# Altium project smd_challenge_extreme.PrjPCB
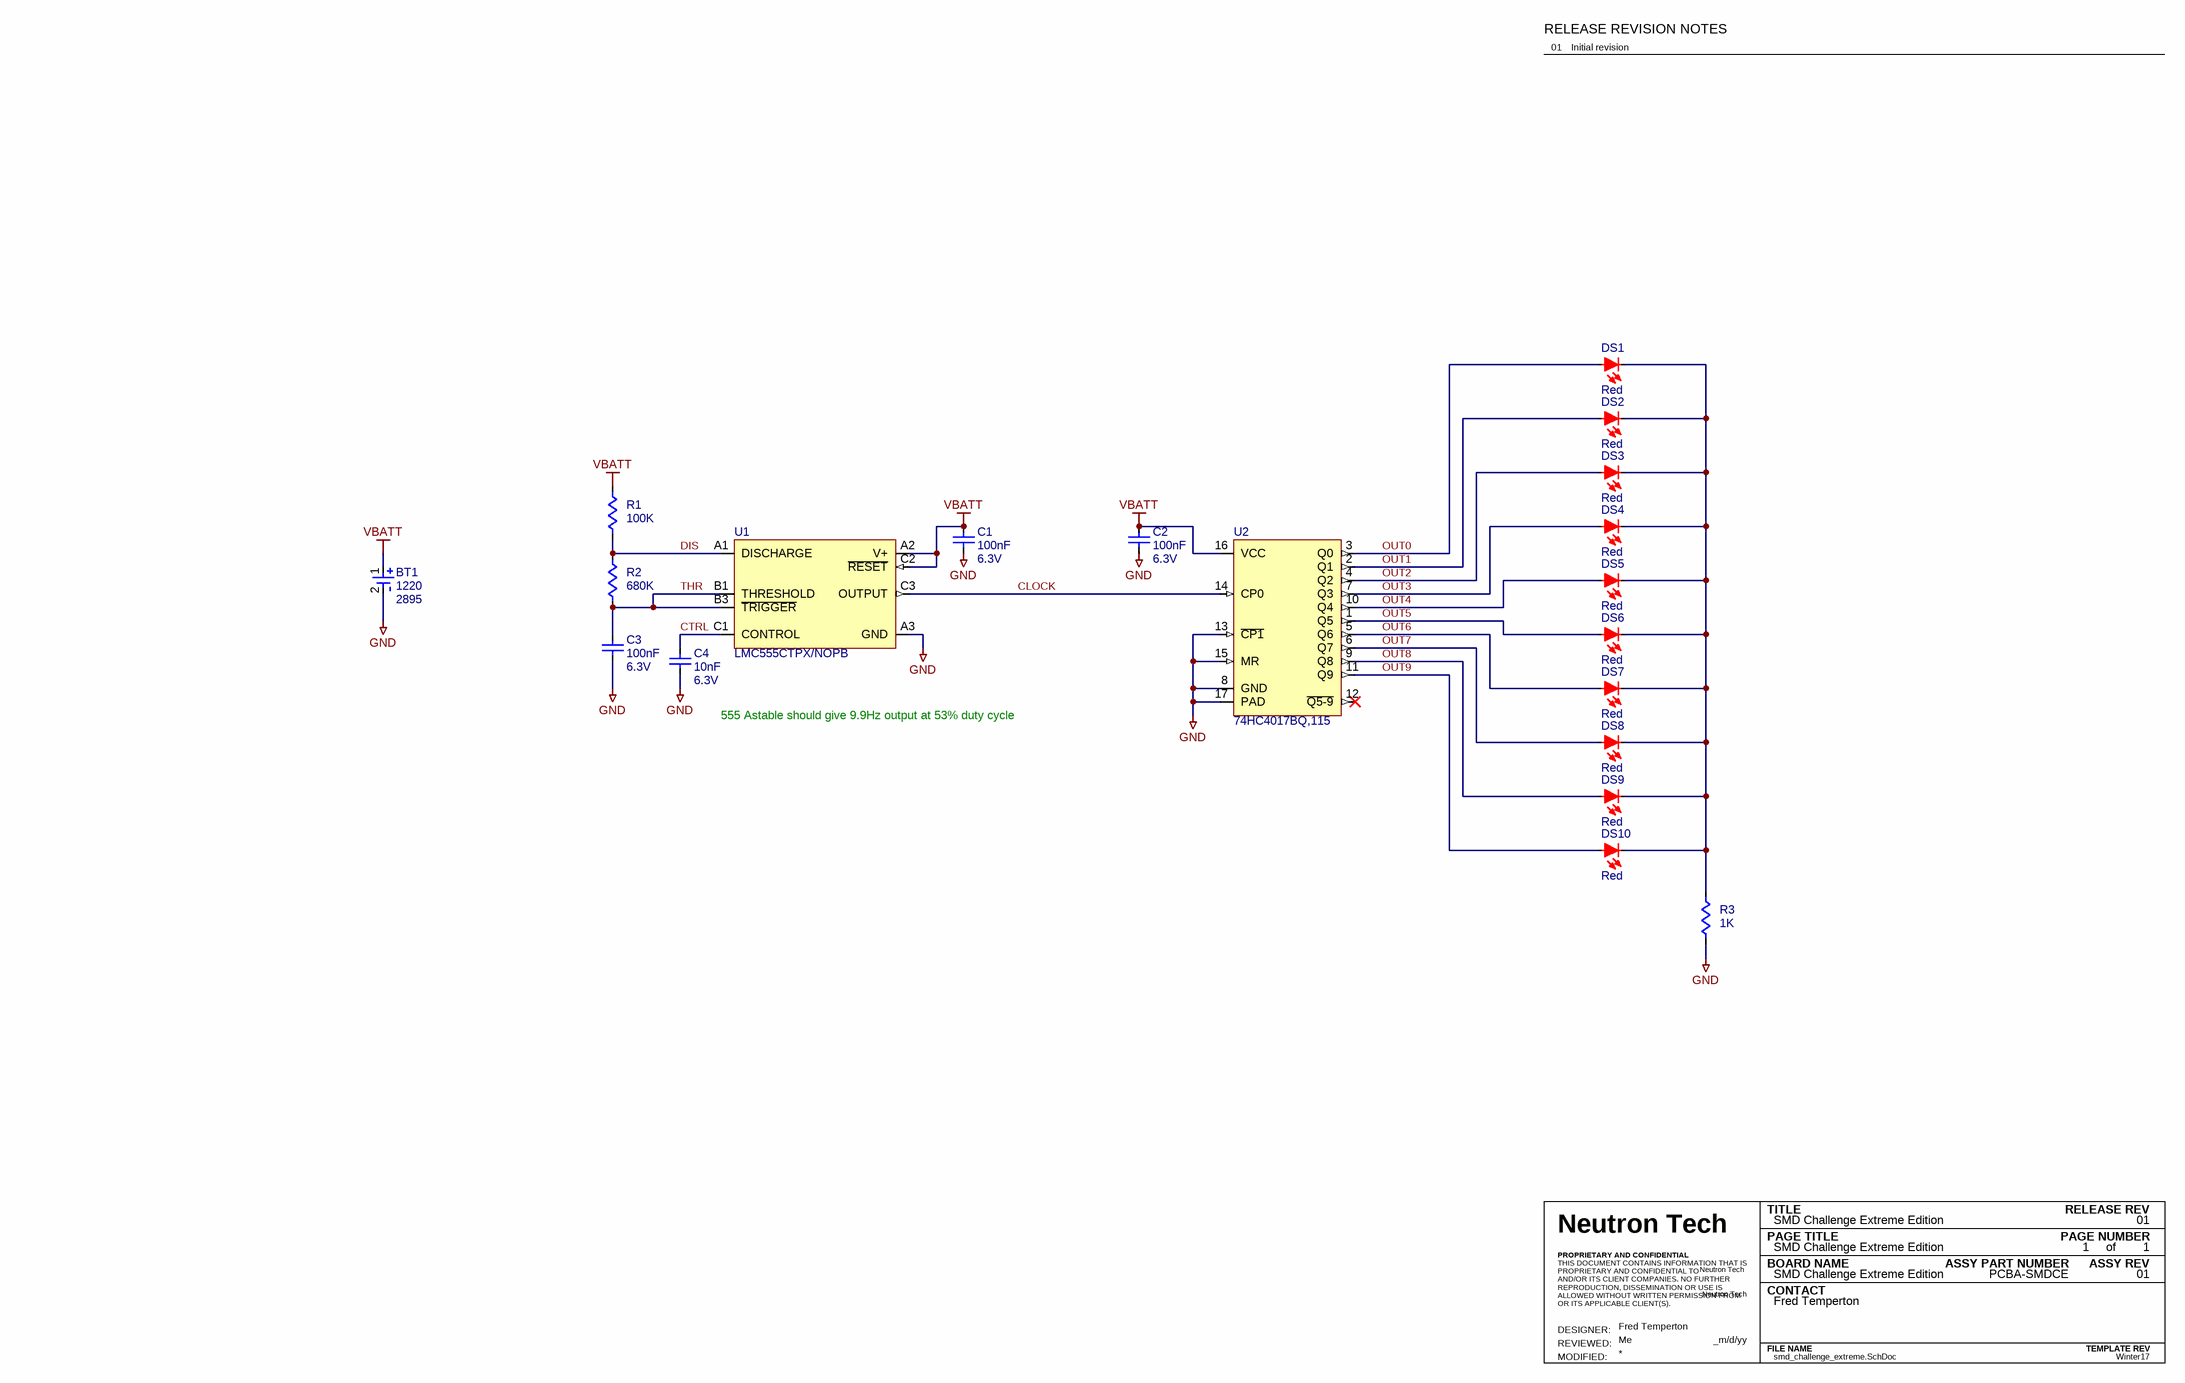
[diagram p0: smd_challenge_extreme.SchDoc]
_ProjectTemplateRev: _Winter17; Year: 2020; SchTitle: SMD Challenge Extreme Edition; ReleaseRev: 01; ReleaseEngineer: .First Last; ReleaseDate: .m/d/yy; FabRev: 01; FabPartNum: PCB-SMDCE; Contact1name: Fred Temperton; Company: Neutron Tech; BoardName: SMD Challenge Extreme Edition; AssyRev: 01; AssyPartNum: PCBA-SMDCE
1 sheet, 20 parts. Net scope: flat (ports and power ports of the same name join across sheets).
Board file: smd_challenge_extreme.PcbDoc

## Sheet smd_challenge_extreme.SchDoc
size 406 x 254 mm; SheetNumber: 1; SheetTotal: 1; PageSetup: Record=PageOptions|CenterHorizontal=True|CenterVertical=True|PrintScale=1.00|XCorrection=1.00|YCorrection=1.00|PrintKind=0|BorderSize=5000000|LeftOffset=0|BottomOffset=0|Orientation=2|PaperLength=1000|PaperWidth=1000|Scale=100|PaperSource=7|PrintQuality=-3|MediaType=1|DitherType=10|PrintScaleMode=0|PaperKind=Tabloid|PaperIndex=3; PageTitle: SMD Challenge Extreme Edition; Designer: Fred Temperton; ReviewedBy: Me; ReviewedDate: _m/d/yy

### Parts
BT1  Size: 1220  Manufacturer Part Number 1: 2895  [BATT1220-KEYSTONE2895]  (hidden comment: ?)
C1  Voltage 1: 6.3V  Capacitance 1: 100nF  [CAPC0402X02N]  (hidden comment: ?)
C2  Voltage 1: 6.3V  Capacitance 1: 100nF  [CAPC0402X02N]  (hidden comment: ?)
C3  Voltage 1: 6.3V  Capacitance 1: 100nF  [CAPC0402X02N]  (hidden comment: ?)
C4  Votlage 1: 6.3V  Capacitance 1: 10nF  [CAPC0402X02N]  (hidden comment: ?)
DS1  Colour: Red  [DIOC0604X02N]  (hidden comment: ?)
DS2  Colour: Red  [DIOC0604X02N]  (hidden comment: ?)
DS3  Colour: Red  [DIOC0604X02N]  (hidden comment: ?)
DS4  Colour: Red  [DIOC0604X02N]  (hidden comment: ?)
DS5  Colour: Red  [DIOC0604X02N]  (hidden comment: ?)
DS6  Colour: Red  [DIOC0604X02N]  (hidden comment: ?)
DS7  Colour: Red  [DIOC0604X02N]  (hidden comment: ?)
DS8  Colour: Red  [DIOC0604X02N]  (hidden comment: ?)
DS9  Colour: Red  [DIOC0604X02N]  (hidden comment: ?)
DS10  Colour: Red  [DIOC0604X02N]  (hidden comment: ?)
R1  Resistance 1: 100K  [RESC0402X01N]  (hidden comment: ?)
R2  Resistance 1: 680K  [RESC0402X01N]  (hidden comment: ?)
R3  Resistance 1: 1K  [RESC0402X01N]  (hidden comment: ?)
U1  Manufacturer Part Number 1: LMC555CTPX/NOPB  [BGA8C50P3X3_141X143X57]  (hidden comment: ?)
U2  Manufacturer Part Number 1: 74HC4017BQ,115  [QFN50P250X350X100_HS-17N]  (hidden comment: ?)

### Nets
GND: BT1.2(-) C1.2 C2.2 C3.2 C4.2 R3.2 U1.A3(GND) U2.8(GND) U2.13(~{CP1}) U2.15(MR) U2.17(PAD)
VBATT: BT1.1(+) C1.1 C2.1 R1.1 U1.A2(V+) U1.C2(~{RESET}) U2.16(VCC)
CLOCK: U1.C3(OUTPUT) U2.14(CP0)
CTRL: C4.1 U1.C1(CONTROL)
DIS: R1.2 R2.1 U1.A1(DISCHARGE)
OUT0: DS1.2(Anode) U2.3(Q0)
OUT1: DS2.2(Anode) U2.2(Q1)
OUT2: DS3.2(Anode) U2.4(Q2)
OUT3: DS4.2(Anode) U2.7(Q3)
OUT4: DS5.2(Anode) U2.10(Q4)
OUT5: DS6.2(Anode) U2.1(Q5)
OUT6: DS7.2(Anode) U2.5(Q6)
OUT7: DS8.2(Anode) U2.6(Q7)
OUT8: DS9.2(Anode) U2.9(Q8)
OUT9: DS10.2(Anode) U2.11(Q9)
THR: C3.1 R2.2 U1.B1(THRESHOLD) U1.B3(~{TRIGGER})
NetDS1_1: DS1.1(Cathode) DS2.1(Cathode) DS3.1(Cathode) DS4.1(Cathode) DS5.1(Cathode) DS6.1(Cathode) DS7.1(Cathode) DS8.1(Cathode) DS9.1(Cathode) DS10.1(Cathode) R3.1

Not connected (* = marked no-connect by the designer): U2 12(~{Q5-9})*

### Notes on the sheet
- RELEASE REVISION NOTES
- 01
- Initial revision
- 555 Astable should give 9.9Hz output at 53% duty cycle
- TITLE
- PAGE TITLE
- PAGE NUMBER
- RELEASE REV
- of
- PROPRIETARY AND CONFIDENTIAL
- THIS DOCUMENT CONTAINS INFORMATION THAT IS PROPRIETARY AND CONFIDENTIAL TO
  AND/OR ITS CLIENT COMPANIES. NO FURTHER REPRODUCTION, DISSEMINATION OR USE IS ALLOWED WITHOUT WRITTEN PERMISSION FROM
  OR ITS APPLICABLE CLIENT(S).
- CONTACT
- BOARD NAME
- ASSY PART NUMBER
- ASSY REV
- DESIGNER:
- REVIEWED:
- MODIFIED:
- FILE NAME
- TEMPLATE REV
- Winter17

### Library data of the parts
BT1 = BAT CELL HOLDER 1220: CR1220 COIN CELL THM RETAINER; Manufacturer 1: Keystone Electronics; _Verified BOM: .mfr-pn?; _Verified Footprint: .mfr-pn? footprint?; _Verified Symbol: .mfr-pn?; Supplier 1: Digi-Key; Supplier Part Number 1: 36-2895-ND; Pricing 1: 1=0.62000, 25=0.52320, 100=0.44520, 250=0.41780, 500=0.37370, 2500=0.37210 (USD)
C1-C3 = CAP 100nF 01005: CAP CER 0.1UF 6.3V X5R 01005; Manufacturer 1: Kyocera AVX; Manufacturer Part Number 1: CM02X5R104M06AH; _Verified Footprint: .mfr-pn? footprint?; _Verified BOM: .mfr-pn?; Description-Param 1: Cap Ceramic 0.1uF 6.3V X5R 20% SMD 01005 85C T/R; Tolerance 1: 20%; _Verified Symbol: .mfr-pn?; Supplier 1: Digi-Key; Supplier Part Number 1: 1253-CM02X5R104M06AHCT-ND; Pricing 1: 1=0.10000, 10=0.05100, 50=0.02780, 100=0.02260, 500=0.01618, 1000=0.01271, 2500=0.01155, 5000=0.01063 (USD); Mount: Surface Mount; Case/Package: Ceramic; Contact Plating: Tin; Min Operating Temperature: -55°C; Max Operating Temperature: 85°C; Length: 0.4mm; ComponentLink1URL: http://global.kyocera.com/prdct/electro/pdf/capacitors/cm_e.pdf?src-supplier=Avnet+Asia; ComponentLink1Description: http://global.kyocera.com/prdct/electro/pdf/capacitors/cm_e.pdf?src-supplier=Avnet+Asia
C4 = CAP 10nF 01005: CAP CER 10000PF 6.3V X7S 01005; Manufacturer 1: Taiyo Yuden; Manufacturer Part Number 1: JMK042C7103KC-W; _Verified Footprint: .mfr-pn? footprint?; _Verified BOM: .mfr-pn?; _Verified Symbol: .mfr-pn?; Supplier 1: Digi-Key; Supplier Part Number 1: 587-6219-1-ND; Description-Param 1: Cap Cer 10000PF 6.3V X7S 01005; Pricing 1: 1=0.10000, 10=0.01200, 50=0.00660, 100=0.00540, 500=0.00386, 1000=0.00303, 2500=0.00275, 5000=0.00253 (USD); ComponentLink1URL: https://www.yuden.co.jp/productdata/catalog/mlcc02_e.pdf?src-supplier=Digi-Key; ComponentLink1Description: https://www.yuden.co.jp/productdata/catalog/mlcc02_e.pdf?src-supplier=Digi-Key
DS1-DS10 = LED RED 0201: LED RED CLEAR 2SMD; Manufacturer 1: Kingbright; Manufacturer Part Number 1: APG0603SEC-E-TT; _Verified Footprint: .mfr-pn? footprint?; _Verified BOM: .mfr-pn?; Lens Color: Colorless; Test Current: 10mA; Dominant Wavelength: 624nm; Forward Voltage: 1.93V; _Verified Symbol: .mfr-pn?; Supplier 1: Digi-Key; Supplier Part Number 1: 754-2028-1-ND; Description-Param 1: LED RED CLEAR 2SMD; Pricing 1: 1=0.43000, 10=0.30600, 100=0.19970, 500=0.14490, 1000=0.11340 (USD); Mount: Surface Mount; Case/Package: SMD/SMT; Lens Transparency: Clear; Length: 0.65mm; Width: 0.35mm; Height 1: 0.25mm; Lead Free: Lead Free; ComponentLink1URL: http://www.kingbrightusa.com/images/catalog/SPEC/APG0603SEC-E-TT.pdf?src-supplier=Digi-Key; ComponentLink1Description: http://www.kingbrightusa.com/images/catalog/SPEC/APG0603SEC-E-TT.pdf?src-supplier=Digi-Key
R1 = RES 100K 01005: RES SMD 100K OHM 1% 1/32W 01005; Manufacturer 1: Cyntec; Manufacturer Part Number 1: PFR02S-104-FNH; _Verified Footprint: .mfr-pn? footprint?; _Verified BOM: .mfr-pn?; _Verified Symbol: .mfr-pn?; Supplier 1: Digi-Key; Supplier Part Number 1: 2037-PFR02S-104-FNHCT-ND; Pricing 1: 1=0.10000, 10=0.02600, 100=0.01060, 1000=0.00477, 2500=0.00414, 5000=0.00342 (USD)
R2 = RES 680K 01005: RES SMD 680K OHM 5% 1/32W 01005; Manufacturer 1: Panasonic; Manufacturer Part Number 1: ERJ-XGNJ684Y; _Verified Footprint: .mfr-pn? footprint?; _Verified BOM: .mfr-pn?; Max Power Dissipation: 30mW; Temperature Coefficient 1: 200ppm/°C; Power Rating: 31mW; Voltage Rating 1: 15V; _Verified Symbol: .mfr-pn?; Supplier 1: Digi-Key; Supplier Part Number 1: P680KAWCT-ND; Description-Param 1: RES SMD 680K OHM 5% 1/32W 01005; Pricing 1: 1=0.16000, 10=0.13200, 100=0.05160, 1000=0.02160, 2500=0.01980, 5000=0.01800 (USD); Mount: Surface Mount; Case/Package: Molded; Case Code (Imperial): 1005; Case Code (Metric): 0402; Min Operating Temperature: -55°C; Max Operating Temperature: 125°C; Resistor Type: Thick Film; Tolerance 1: 5%; Length: 0.016inch; Width: 0.008inch; Height 1: 0.006inch; ComponentLink1URL: https://datasheet.ciiva.com/6553/erjxgn-6553846.pdf?src-supplier=Digi-Key; ComponentLink1Description: https://datasheet.ciiva.com/6553/erjxgn-6553846.pdf?src-supplier=Digi-Key; ComponentLink2URL: https://datasheet.ciiva.com/6553/erjxgn-6553848.pdf?src-supplier=Digi-Key; ComponentLink2Description: https://datasheet.ciiva.com/6553/erjxgn-6553848.pdf?src-supplier=Digi-Key
R3 = RES 1K 01005: RES SMD 1K OHM 1% 1/32W 01005; Manufacturer 1: Cyntec; Manufacturer Part Number 1: PFR02S-102-FNH; _Verified Footprint: .mfr-pn? footprint?; _Verified BOM: .mfr-pn?; _Verified Symbol: .mfr-pn?; Supplier 1: Digi-Key; Supplier Part Number 1: 2037-PFR02S-102-FNHCT-ND; Pricing 1: 1=0.10000, 10=0.02600, 100=0.01060, 1000=0.00477, 2500=0.00414, 5000=0.00342 (USD)
U1 = IC LMC555CTPX: IC OSC SINGLE TIMER 3MHZ 8-USMD; Manufacturer 1: TI National Semiconductor; _Verified Footprint: .mfr-pn? footprint?; _Verified BOM: .mfr-pn?; Operating Supply Current: 150uA; Propagation Delay: 100ns; Max Power Dissipation: 568mW; Max Supply Voltage: 15V; Min Supply Voltage: 1.5V; Nominal Supply Current: 50uA; Number of Timers/Counters: 1; High Level Output Current: -10mA; Low Level Output Current: 50mA; Output Current: 100mA; _Verified Symbol: .mfr-pn?; Supplier 1: Digi-Key; Supplier Part Number 1: 296-46430-1-ND; Description-Param 1: IC OSC SINGLE TIMER 3MHZ 8-USMD; Pricing 1: 1=1.27000, 10=1.13300, 25=1.07520, 100=0.88320, 250=0.82560, 500=0.72960, 1000=0.57600 (USD); Mount: Surface Mount; Number of Pins: 8; Min Operating Temperature: -40°C; Max Operating Temperature: 125°C; Power Dissipation: 568mW; Turn-On Delay Time: 100ns; Quiescent Current: 50uA; Radiation Hardening: No; Lead Free: Lead Free; ComponentLink1URL: https://datasheet.ciiva.com/6666/lmc555-6666976.pdf?src-supplier=Digi-Key; ComponentLink1Description: https://datasheet.ciiva.com/6666/lmc555-6666976.pdf?src-supplier=Digi-Key; ComponentLink2URL: https://datasheet.ciiva.com/15152/getdatasheetpartid-628891-15152597.pdf?src-supplier=Verical; ComponentLink2Description: https://datasheet.ciiva.com/15152/getdatasheetpartid-628891-15152597.pdf?src-supplier=Verical; ComponentLink3URL: https://datasheet.ciiva.com/14274/lmc555-14274422.pdf?src-supplier=Avnet; ComponentLink3Description: https://datasheet.ciiva.com/14274/lmc555-14274422.pdf?src-supplier=Avnet; ComponentLink4URL: https://datasheet.ciiva.com/14274/lmc555-14274486.pdf?src-supplier=Avnet; ComponentLink4Description: https://datasheet.ciiva.com/14274/lmc555-14274486.pdf?src-supplier=Avnet; Frequency 1: 3MHz
U2 = IC 74HC4017BQ: IC JOHNSON DECADE CNTR 16-DHVQFN; Manufacturer 1: Nexperia; _Verified Footprint: .mfr-pn? footprint?; _Verified BOM: .mfr-pn?; Description-Param 1: 74HC4017; 74HCT4017 - Johnson decade counter with 10 decoded outputs; _Verified Symbol: .mfr-pn?; Pricing 1: 1=0.53000, 10=0.45000, 25=0.42000, 100=0.33600, 250=0.31200, 500=0.26400, 1000=0.20400 (USD); ComponentLink1URL: http://datasheet.octopart.com/74HC4017BQ%2C115-Nexperia-datasheet-86672705.pdf?src-supplier=Nexperia; ComponentLink1Description: http://datasheet.octopart.com/74HC4017BQ%2C115-Nexperia-datasheet-86672705.pdf?src-supplier=Nexperia; ComponentLink2URL: http://datasheet.octopart.com/74HC4017BQ%2C115-Philips-datasheet-547741.pdf?src-supplier=NXP+Semiconductors; ComponentLink2Description: http://datasheet.octopart.com/74HC4017BQ%2C115-Philips-datasheet-547741.pdf?src-supplier=NXP+Semiconductors; Supplier 1: Digi-Key; Supplier Part Number 1: 1727-7943-1-ND

## Assembly variants
Production: all parts fitted